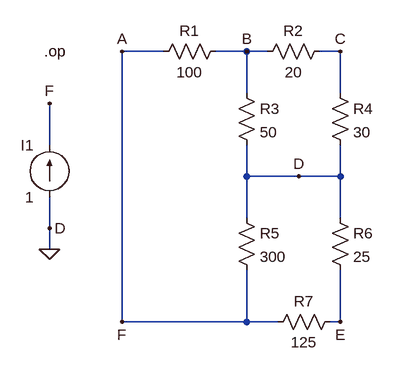
[diagram p0: schematic lab4.asc]
lab4.asc, the LTspice schematic file:
Version 4
SHEET 1 880 680
WIRE 272 144 208 144
WIRE 400 144 352 144
WIRE 432 144 400 144
WIRE 544 144 512 144
WIRE 400 208 400 144
WIRE 544 208 544 144
WIRE 96 288 96 224
WIRE 400 336 400 288
WIRE 480 336 400 336
WIRE 544 336 544 288
WIRE 544 336 480 336
WIRE 400 400 400 336
WIRE 544 400 544 336
WIRE 96 416 96 368
WIRE 96 448 96 416
WIRE 208 560 208 144
WIRE 400 560 400 480
WIRE 400 560 208 560
WIRE 448 560 400 560
WIRE 544 560 544 480
WIRE 544 560 528 560
FLAG 96 224 F
FLAG 400 144 B
FLAG 544 144 C
FLAG 480 336 D
FLAG 544 560 E
FLAG 208 560 F
FLAG 96 448 0
FLAG 208 144 A
FLAG 96 416 D
SYMBOL res 368 128 R90
WINDOW 0 0 56 VBottom 2
WINDOW 3 32 56 VTop 2
SYMATTR InstName R1
SYMATTR Value 100
SYMBOL res 528 128 R90
WINDOW 0 0 56 VBottom 2
WINDOW 3 32 56 VTop 2
SYMATTR InstName R2
SYMATTR Value 20
SYMBOL res 384 192 R0
SYMATTR InstName R3
SYMATTR Value 50
SYMBOL res 528 192 R0
SYMATTR InstName R4
SYMATTR Value 30
SYMBOL res 384 384 R0
SYMATTR InstName R5
SYMATTR Value 300
SYMBOL res 528 384 R0
SYMATTR InstName R6
SYMATTR Value 25
SYMBOL res 544 544 R90
WINDOW 0 0 56 VBottom 2
WINDOW 3 32 56 VTop 2
SYMATTR InstName R7
SYMATTR Value 125
SYMBOL current 96 368 R180
WINDOW 0 24 80 Left 2
WINDOW 3 24 0 Left 2
SYMATTR InstName I1
SYMATTR Value 1
TEXT 88 144 Left 2 !.op

The netlist it stands for:
* lab4.asc
R1 B A 100
R2 C B 20
R3 B 0 50
R4 C 0 30
R5 0 A 300
R6 0 E 25
R7 E A 125
I1 0 A 1
.op
.backanno
.end